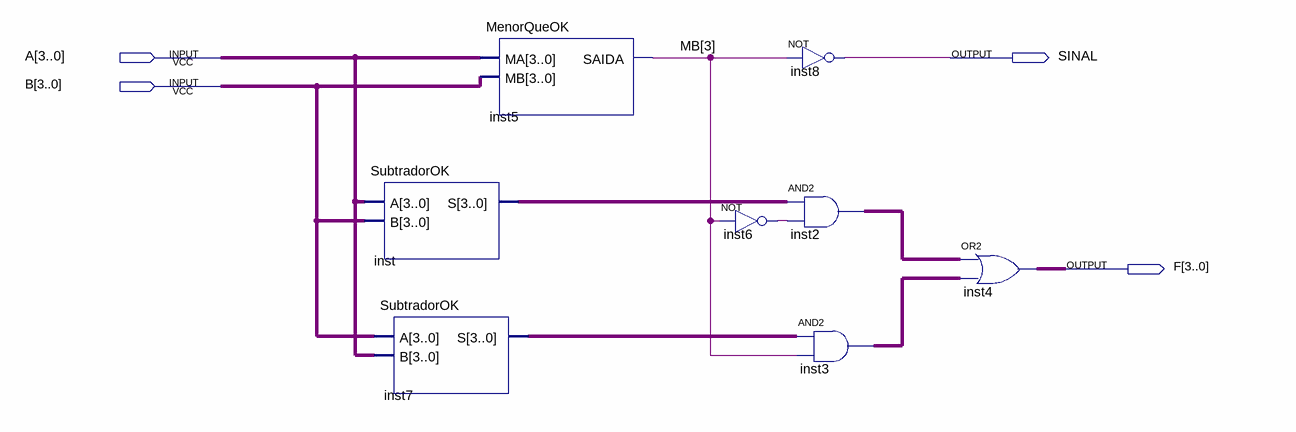
[diagram p0: schematic sheet]
// Quartus schematic SubtradorCompletoOK2.bdf as structural Verilog: 8 symbols, 4 pins
module SubtradorCompletoOK2 (
  input  [3:0] A,
  input  [3:0] B,
  output SINAL,
  output [3:0] F
);

  wire inst6_out;
  wire [3:0] inst2_out, inst3_out, inst7_s, inst_s;
  wire [3:3] MB;

  SubtradorOK inst (.A(A), .B(B), .S(inst_s));
  SubtradorOK inst7 (.A(B), .B(A), .S(inst7_s));
  MenorQueOK inst5 (.MA(A), .MB(B), .SAIDA(MB[3]));
  not inst6 (inst6_out, MB[3]);
  not inst8 (SINAL, MB[3]);
  assign inst2_out = inst_s & {4{inst6_out}};  // AND2 inst2, 4 bits wide
  assign inst3_out = inst7_s & {4{MB[3]}};  // AND2 inst3, 4 bits wide
  assign F = inst2_out | inst3_out;  // OR2 inst4, 4 bits wide
endmodule
